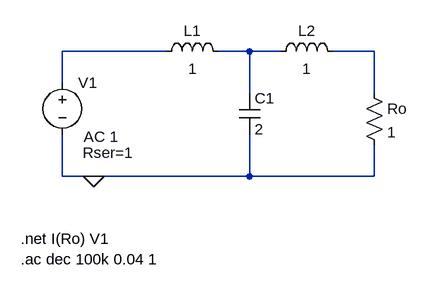
[diagram p0: schematic Punto1.asc]
Punto1.asc, the LTspice schematic file:
Version 4
SHEET 1 880 680
WIRE 64 128 -96 128
WIRE 192 128 144 128
WIRE 240 128 192 128
WIRE 384 128 320 128
WIRE -96 176 -96 128
WIRE 192 192 192 128
WIRE 384 192 384 128
WIRE -96 320 -96 256
WIRE -48 320 -96 320
WIRE 192 320 192 256
WIRE 192 320 -48 320
WIRE 384 320 384 272
WIRE 384 320 192 320
FLAG -48 320 0
SYMBOL ind 48 144 R270
WINDOW 0 32 56 VTop 2
WINDOW 3 5 56 VBottom 2
SYMATTR InstName L1
SYMATTR Value 1
SYMBOL cap 176 192 R0
SYMATTR InstName C1
SYMATTR Value 2
SYMBOL ind 224 144 R270
WINDOW 0 32 56 VTop 2
WINDOW 3 5 56 VBottom 2
SYMATTR InstName L2
SYMATTR Value 1
SYMBOL voltage -96 160 R0
WINDOW 123 33 99 Left 2
WINDOW 39 31 124 Left 2
SYMATTR InstName V1
SYMATTR Value ""
SYMATTR Value2 AC 1
SYMATTR SpiceLine Rser=1
SYMBOL res 368 176 R0
SYMATTR InstName Ro
SYMATTR Value 1
TEXT -160 448 Left 2 !.ac dec 100k 0.04 1
TEXT -160 416 Left 2 !.net I(Ro) V1

The netlist it stands for:
* Punto1.asc
L1 N001 N002 1
C1 N002 0 2
L2 N002 N003 1
V1 N001 0 AC 1 Rser=1
Ro N003 0 1
.ac dec 100k 0.04 1
.net I(Ro) V1
.backanno
.end